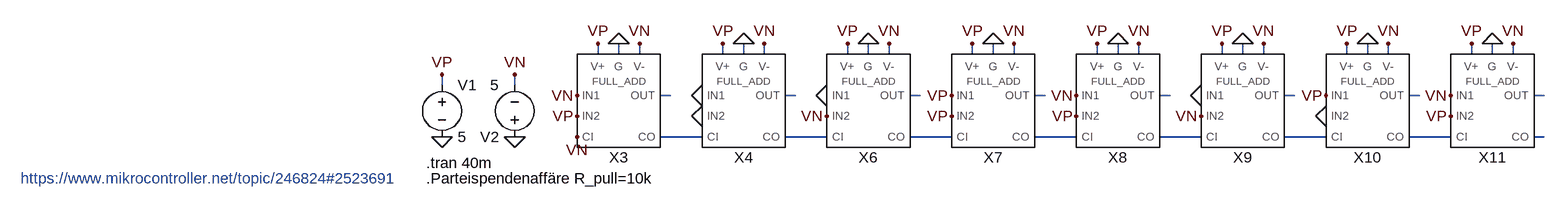
[diagram p0: schematic adder_example.asc]
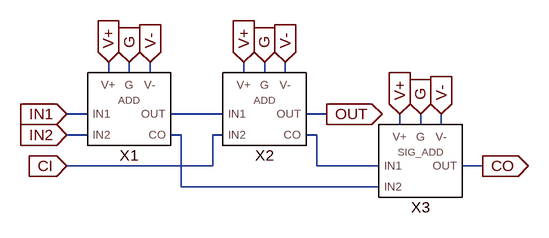
[diagram p1: sub-circuit tri_fulladd.asc]
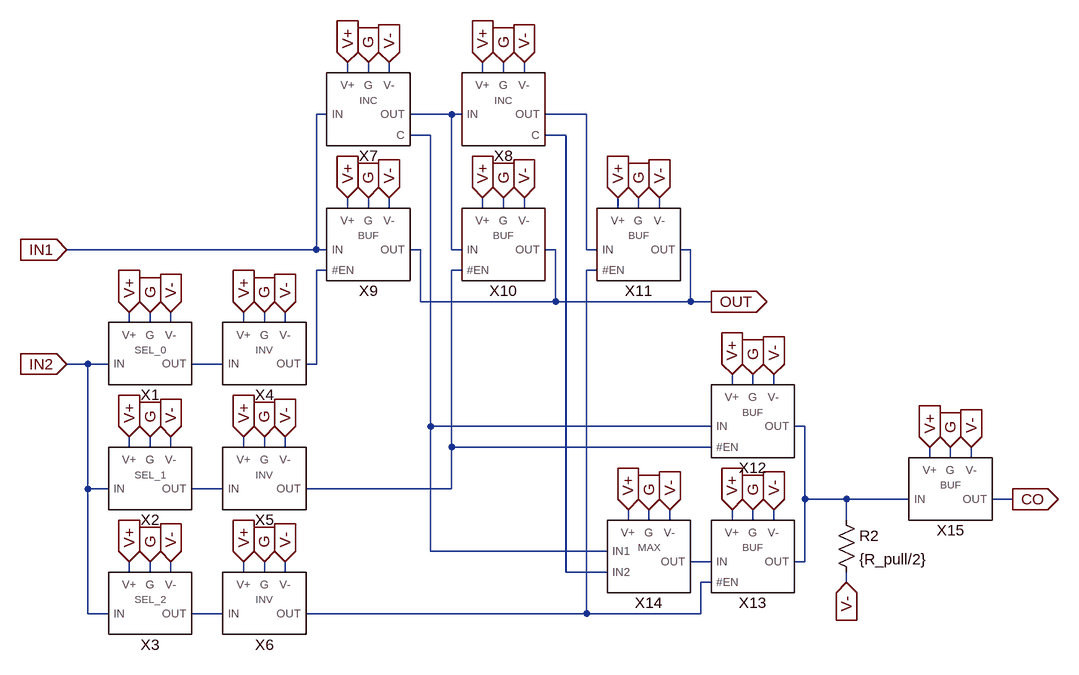
[diagram p2: sub-circuit tri_add.asc]
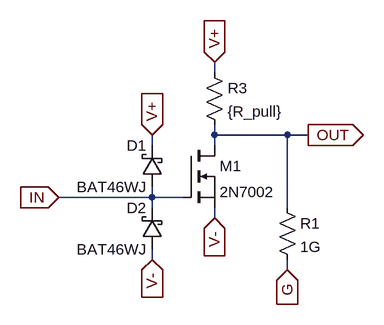
[diagram p3: sub-circuit tri_sel0.asc]
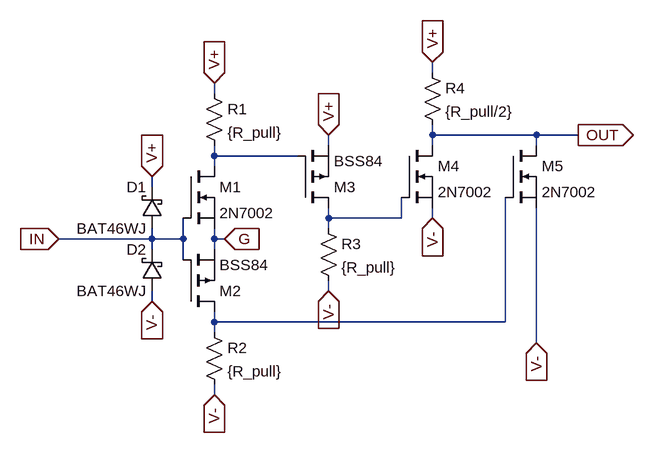
[diagram p4: sub-circuit tri_sel1.asc]
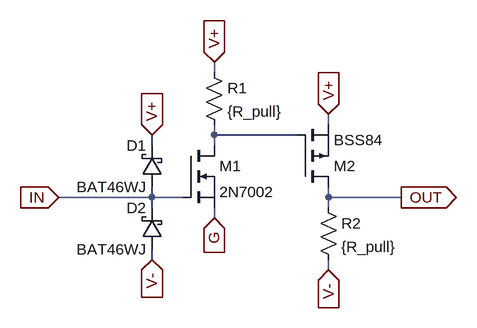
[diagram p5: sub-circuit tri_sel2.asc]
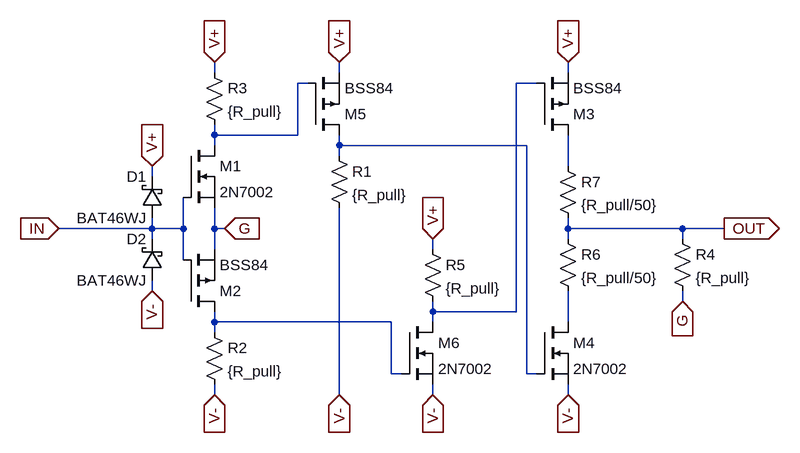
[diagram p6: sub-circuit tri_inv.asc]
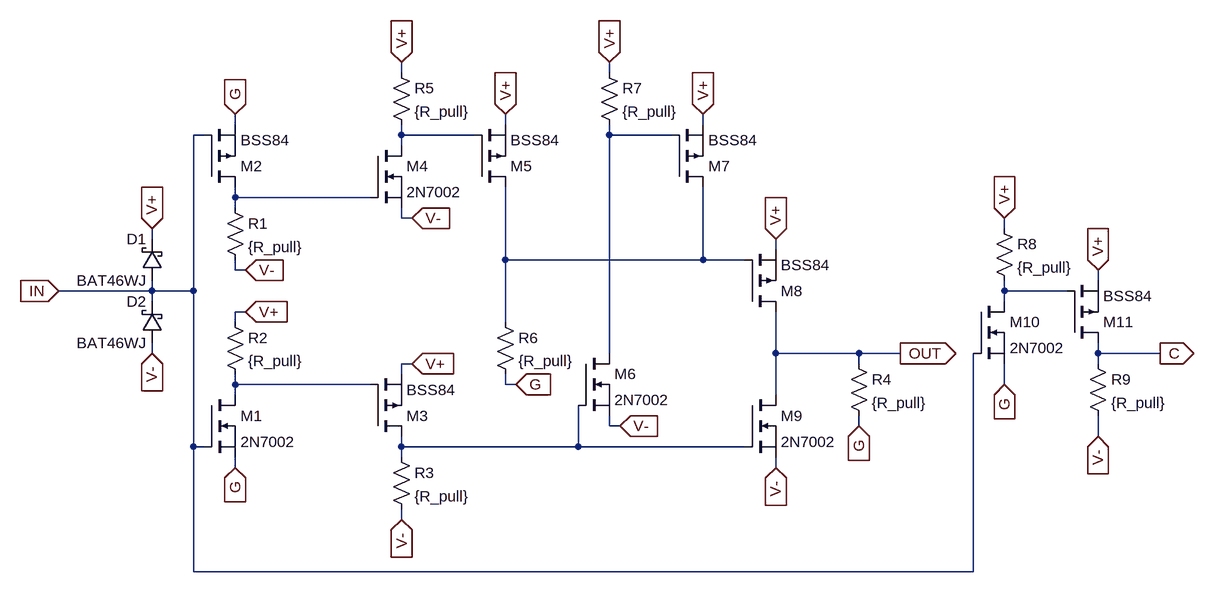
[diagram p7: sub-circuit tri_inc1.asc]
adder_example.asc, the LTspice schematic file:
Version 4
SHEET 1 8420 3552
WIRE -512 208 -512 192
WIRE -480 208 -480 192
WIRE -448 208 -448 192
WIRE -320 208 -320 192
WIRE -288 208 -288 192
WIRE -256 208 -256 192
WIRE -128 208 -128 192
WIRE -96 208 -96 192
WIRE -64 208 -64 192
WIRE 64 208 64 192
WIRE 96 208 96 192
WIRE 128 208 128 192
WIRE 256 208 256 192
WIRE 288 208 288 192
WIRE 320 208 320 192
WIRE 448 208 448 192
WIRE 480 208 480 192
WIRE 512 208 512 192
WIRE 640 208 640 192
WIRE 672 208 672 192
WIRE 704 208 704 192
WIRE 832 208 832 192
WIRE 864 208 864 192
WIRE 896 208 896 192
WIRE -752 256 -752 240
WIRE -640 256 -640 240
WIRE -400 272 -416 272
WIRE -208 272 -224 272
WIRE -16 272 -32 272
WIRE 176 272 160 272
WIRE 368 272 352 272
WIRE 560 272 544 272
WIRE 752 272 736 272
WIRE 944 272 928 272
WIRE -352 336 -416 336
WIRE -160 336 -224 336
WIRE 32 336 -32 336
WIRE 224 336 160 336
WIRE 416 336 352 336
WIRE 608 336 544 336
WIRE 800 336 736 336
WIRE 944 336 928 336
FLAG -752 336 0
FLAG -640 336 0
FLAG -640 240 VN
FLAG -752 240 VP
FLAG -480 192 0
FLAG -512 192 VP
FLAG -448 192 VN
FLAG -288 192 0
FLAG -320 192 VP
FLAG -256 192 VN
FLAG -96 192 0
FLAG -128 192 VP
FLAG -64 192 VN
FLAG 96 192 0
FLAG 64 192 VP
FLAG 128 192 VN
FLAG 288 192 0
FLAG 256 192 VP
FLAG 320 192 VN
FLAG 480 192 0
FLAG 448 192 VP
FLAG 512 192 VN
FLAG 672 192 0
FLAG 640 192 VP
FLAG 704 192 VN
FLAG 864 192 0
FLAG 832 192 VP
FLAG 896 192 VN
FLAG -544 272 VN
FLAG -544 304 VP
FLAG -352 272 0
FLAG -160 272 0
FLAG 32 272 VP
FLAG 224 272 VN
FLAG 416 272 0
FLAG 608 272 VP
FLAG 800 272 VN
FLAG -352 304 0
FLAG -160 304 VN
FLAG 32 304 VP
FLAG 224 304 VP
FLAG 416 304 VN
FLAG 608 304 0
FLAG 800 304 VP
FLAG -544 336 VN
SYMBOL voltage -752 240 R0
WINDOW 123 0 0 Left 0
WINDOW 39 0 0 Left 0
SYMATTR InstName V1
SYMATTR Value 5
SYMBOL voltage -640 352 R180
WINDOW 123 0 0 Left 0
WINDOW 39 0 0 Left 0
SYMATTR InstName V2
SYMATTR Value 5
SYMBOL tri_fulladd -480 272 R0
SYMATTR InstName X3
SYMBOL tri_fulladd -288 272 R0
SYMATTR InstName X4
SYMBOL tri_fulladd -96 272 R0
SYMATTR InstName X6
SYMBOL tri_fulladd 96 272 R0
SYMATTR InstName X7
SYMBOL tri_fulladd 288 272 R0
SYMATTR InstName X8
SYMBOL tri_fulladd 480 272 R0
SYMATTR InstName X9
SYMBOL tri_fulladd 672 272 R0
SYMATTR InstName X10
SYMBOL tri_fulladd 864 272 R0
SYMATTR InstName X11
TEXT -776 376 Left 2 !.tran 40m
TEXT -776 400 Left 2 !.Parteispendenaffäre R_pull=10k
TEXT -1400 400 Left 2 ;https://www.mikrocontroller.net/topic/246824#2523691

tri_fulladd.asc, the sub-circuit schematic file:
Version 4
SHEET 1 1568 944
WIRE 448 400 448 384
WIRE 480 400 480 384
WIRE 512 400 512 384
WIRE 656 400 656 384
WIRE 688 400 688 384
WIRE 720 400 720 384
WIRE 416 464 384 464
WIRE 624 464 544 464
WIRE 784 464 752 464
WIRE 896 480 896 464
WIRE 928 480 928 464
WIRE 960 480 960 464
WIRE 416 496 384 496
WIRE 560 496 544 496
WIRE 624 496 608 496
WIRE 768 496 752 496
WIRE 608 544 608 496
WIRE 608 544 384 544
WIRE 768 544 768 496
WIRE 864 544 768 544
WIRE 1024 544 992 544
WIRE 560 576 560 496
WIRE 864 576 560 576
FLAG 384 464 IN1
IOPIN 384 464 In
FLAG 384 496 IN2
IOPIN 384 496 In
FLAG 1024 544 CO
IOPIN 1024 544 Out
FLAG 384 544 CI
IOPIN 384 544 In
FLAG 448 384 V+
IOPIN 448 384 In
FLAG 480 384 G
IOPIN 480 384 In
FLAG 512 384 V-
IOPIN 512 384 In
FLAG 656 384 V+
IOPIN 656 384 In
FLAG 688 384 G
IOPIN 688 384 In
FLAG 720 384 V-
IOPIN 720 384 In
FLAG 896 464 V+
IOPIN 896 464 In
FLAG 928 464 G
IOPIN 928 464 In
FLAG 960 464 V-
IOPIN 960 464 In
FLAG 784 464 OUT
IOPIN 784 464 Out
SYMBOL tri_add 480 464 R0
SYMATTR InstName X1
SYMBOL tri_add 688 464 R0
SYMATTR InstName X2
SYMBOL tri_sigadd 928 544 R0
SYMATTR InstName X3

tri_add.asc, the sub-circuit schematic file:
Version 4
SHEET 1 1568 944
WIRE 384 -64 384 -80
WIRE 416 -64 416 -80
WIRE 448 -64 448 -80
WIRE 592 -64 592 -80
WIRE 624 -64 624 -80
WIRE 656 -64 656 -80
WIRE 352 0 336 0
WIRE 544 0 480 0
WIRE 560 0 544 0
WIRE 752 0 688 0
WIRE 512 32 480 32
WIRE 720 32 688 32
WIRE 384 144 384 128
WIRE 416 144 416 128
WIRE 448 144 448 128
WIRE 592 144 592 128
WIRE 624 144 624 128
WIRE 656 144 656 128
WIRE 800 144 800 128
WIRE 832 144 832 128
WIRE 864 144 864 128
WIRE 336 208 336 0
WIRE 336 208 -48 208
WIRE 352 208 336 208
WIRE 496 208 480 208
WIRE 544 208 544 0
WIRE 560 208 544 208
WIRE 704 208 688 208
WIRE 752 208 752 0
WIRE 768 208 752 208
WIRE 912 208 896 208
WIRE 352 240 336 240
WIRE 560 240 544 240
WIRE 768 240 752 240
WIRE 496 288 496 208
WIRE 704 288 704 208
WIRE 704 288 496 288
WIRE 912 288 912 208
WIRE 912 288 704 288
WIRE 944 288 912 288
WIRE 48 320 48 304
WIRE 80 320 80 304
WIRE 112 320 112 304
WIRE 224 320 224 304
WIRE 256 320 256 304
WIRE 288 320 288 304
WIRE -16 384 -48 384
WIRE 16 384 -16 384
WIRE 192 384 144 384
WIRE 336 384 336 240
WIRE 336 384 320 384
WIRE 976 416 976 400
WIRE 1008 416 1008 400
WIRE 1040 416 1040 400
WIRE 512 480 512 32
WIRE 944 480 512 480
WIRE 1088 480 1072 480
WIRE 48 512 48 496
WIRE 80 512 80 496
WIRE 112 512 112 496
WIRE 224 512 224 496
WIRE 256 512 256 496
WIRE 288 512 288 496
WIRE 544 512 544 240
WIRE 944 512 544 512
WIRE 1280 528 1280 512
WIRE 1312 528 1312 512
WIRE 1344 528 1344 512
WIRE -16 576 -16 384
WIRE 16 576 -16 576
WIRE 192 576 144 576
WIRE 544 576 544 512
WIRE 544 576 320 576
WIRE 1088 592 1088 480
WIRE 1152 592 1088 592
WIRE 1248 592 1152 592
WIRE 1408 592 1376 592
WIRE 816 624 816 608
WIRE 848 624 848 608
WIRE 880 624 880 608
WIRE 976 624 976 608
WIRE 1008 624 1008 608
WIRE 1040 624 1040 608
WIRE 1152 624 1152 592
WIRE 512 672 512 480
WIRE 784 672 512 672
WIRE 944 688 912 688
WIRE 1088 688 1088 592
WIRE 1088 688 1072 688
WIRE 48 704 48 688
WIRE 80 704 80 688
WIRE 112 704 112 688
WIRE 224 704 224 688
WIRE 256 704 256 688
WIRE 288 704 288 688
WIRE 720 704 720 32
WIRE 784 704 720 704
WIRE 944 720 928 720
WIRE 1152 720 1152 704
WIRE -16 768 -16 576
WIRE 16 768 -16 768
WIRE 192 768 144 768
WIRE 752 768 752 240
WIRE 752 768 320 768
WIRE 928 768 928 720
WIRE 928 768 752 768
FLAG -48 208 IN1
IOPIN -48 208 In
FLAG 944 288 OUT
IOPIN 944 288 Out
FLAG -48 384 IN2
IOPIN -48 384 In
FLAG 48 304 V+
IOPIN 48 304 In
FLAG 80 304 G
IOPIN 80 304 In
FLAG 112 304 V-
IOPIN 112 304 In
FLAG 1408 592 CO
IOPIN 1408 592 Out
FLAG 224 304 V+
IOPIN 224 304 In
FLAG 256 304 G
IOPIN 256 304 In
FLAG 288 304 V-
IOPIN 288 304 In
FLAG 48 496 V+
IOPIN 48 496 In
FLAG 80 496 G
IOPIN 80 496 In
FLAG 112 496 V-
IOPIN 112 496 In
FLAG 224 496 V+
IOPIN 224 496 In
FLAG 256 496 G
IOPIN 256 496 In
FLAG 288 496 V-
IOPIN 288 496 In
FLAG 48 688 V+
IOPIN 48 688 In
FLAG 80 688 G
IOPIN 80 688 In
FLAG 112 688 V-
IOPIN 112 688 In
FLAG 224 688 V+
IOPIN 224 688 In
FLAG 256 688 G
IOPIN 256 688 In
FLAG 288 688 V-
IOPIN 288 688 In
FLAG 816 608 V+
IOPIN 816 608 In
FLAG 848 608 G
IOPIN 848 608 In
FLAG 880 608 V-
IOPIN 880 608 In
FLAG 976 608 V+
IOPIN 976 608 In
FLAG 1008 608 G
IOPIN 1008 608 In
FLAG 1040 608 V-
IOPIN 1040 608 In
FLAG 976 400 V+
IOPIN 976 400 In
FLAG 1008 400 G
IOPIN 1008 400 In
FLAG 1040 400 V-
IOPIN 1040 400 In
FLAG 1152 720 V-
IOPIN 1152 720 In
FLAG 1280 512 V+
IOPIN 1280 512 In
FLAG 1312 512 G
IOPIN 1312 512 In
FLAG 1344 512 V-
IOPIN 1344 512 In
FLAG 800 128 V+
IOPIN 800 128 In
FLAG 832 128 G
IOPIN 832 128 In
FLAG 864 128 V-
IOPIN 864 128 In
FLAG 592 128 V+
IOPIN 592 128 In
FLAG 624 128 G
IOPIN 624 128 In
FLAG 656 128 V-
IOPIN 656 128 In
FLAG 384 128 V+
IOPIN 384 128 In
FLAG 416 128 G
IOPIN 416 128 In
FLAG 448 128 V-
IOPIN 448 128 In
FLAG 384 -80 V+
IOPIN 384 -80 In
FLAG 416 -80 G
IOPIN 416 -80 In
FLAG 448 -80 V-
IOPIN 448 -80 In
FLAG 592 -80 V+
IOPIN 592 -80 In
FLAG 624 -80 G
IOPIN 624 -80 In
FLAG 656 -80 V-
IOPIN 656 -80 In
SYMBOL tri_sel0 80 384 R0
SYMATTR InstName X1
SYMBOL tri_sel1 80 576 R0
SYMATTR InstName X2
SYMBOL tri_sel2 80 768 R0
SYMATTR InstName X3
SYMBOL tri_inv 256 384 R0
SYMATTR InstName X4
SYMBOL tri_inv 256 576 R0
SYMATTR InstName X5
SYMBOL tri_inv 256 768 R0
SYMATTR InstName X6
SYMBOL tri_inc1 416 0 R0
SYMATTR InstName X7
SYMBOL tri_inc1 624 0 R0
SYMATTR InstName X8
SYMBOL tri_buffer2 416 208 R0
SYMATTR InstName X9
SYMBOL tri_buffer2 624 208 R0
SYMATTR InstName X10
SYMBOL tri_buffer2 832 208 R0
SYMATTR InstName X11
SYMBOL tri_buffer2 1008 480 R0
SYMATTR InstName X12
SYMBOL tri_buffer2 1008 688 R0
SYMATTR InstName X13
SYMBOL tri_max1 848 688 R0
SYMATTR InstName X14
SYMBOL res 1136 608 R0
SYMATTR InstName R2
SYMATTR Value {R_pull/2}
SYMBOL tri_buffer1 1312 592 R0
SYMATTR InstName X15

tri_sel0.asc, the sub-circuit schematic file:
Version 4
SHEET 1 880 680
WIRE 32 16 32 0
WIRE 32 112 32 96
WIRE 144 112 32 112
WIRE 176 112 144 112
WIRE -64 128 -64 112
WIRE 32 128 32 112
WIRE -64 208 -64 192
WIRE -64 208 -208 208
WIRE -16 208 -64 208
WIRE -64 224 -64 208
WIRE 144 224 144 112
WIRE 32 240 32 224
WIRE -64 304 -64 288
WIRE 144 320 144 304
FLAG -64 112 V+
IOPIN -64 112 In
FLAG -64 304 V-
IOPIN -64 304 In
FLAG -208 208 IN
IOPIN -208 208 In
FLAG 176 112 OUT
IOPIN 176 112 Out
FLAG 32 0 V+
IOPIN 32 0 In
FLAG 32 240 V-
IOPIN 32 240 In
FLAG 144 320 G
IOPIN 144 320 In
SYMBOL nmos -16 128 R0
SYMATTR InstName M1
SYMATTR Value 2N7002
SYMBOL schottky -48 192 R180
WINDOW 0 24 64 Left 2
WINDOW 3 24 0 Left 2
SYMATTR InstName D1
SYMATTR Value BAT46WJ
SYMATTR Description Diode
SYMATTR Type diode
SYMBOL schottky -48 288 R180
WINDOW 0 24 64 Left 2
WINDOW 3 24 0 Left 2
SYMATTR InstName D2
SYMATTR Value BAT46WJ
SYMATTR Description Diode
SYMATTR Type diode
SYMBOL res 16 0 R0
SYMATTR InstName R3
SYMATTR Value {R_pull}
SYMBOL res 128 208 R0
SYMATTR InstName R1
SYMATTR Value 1G

tri_sel1.asc, the sub-circuit schematic file:
Version 4
SHEET 1 1212 1108
WIRE 368 -48 368 -64
WIRE 32 -16 32 -32
WIRE 368 48 368 32
WIRE 528 48 368 48
WIRE 592 48 528 48
WIRE 208 64 208 48
WIRE 368 64 368 48
WIRE 528 64 528 48
WIRE 32 80 32 64
WIRE 160 80 32 80
WIRE 32 96 32 80
WIRE -64 128 -64 112
WIRE 208 176 208 160
WIRE 320 176 320 144
WIRE 320 176 208 176
WIRE 368 176 368 160
WIRE 208 192 208 176
WIRE -64 208 -64 192
WIRE -64 208 -208 208
WIRE -16 208 -16 176
WIRE -16 208 -64 208
WIRE 32 208 32 192
WIRE 48 208 32 208
WIRE -64 224 -64 208
WIRE 32 224 32 208
WIRE -16 240 -16 208
WIRE 208 288 208 272
WIRE -64 304 -64 288
WIRE 32 336 32 320
WIRE 480 336 480 144
WIRE 480 336 32 336
WIRE 32 352 32 336
WIRE 528 368 528 160
WIRE 32 448 32 432
FLAG -64 112 V+
IOPIN -64 112 In
FLAG -64 304 V-
IOPIN -64 304 In
FLAG 48 208 G
IOPIN 48 208 In
FLAG -208 208 IN
IOPIN -208 208 In
FLAG 592 48 OUT
IOPIN 592 48 Out
FLAG 32 -32 V+
IOPIN 32 -32 In
FLAG 208 48 V+
IOPIN 208 48 In
FLAG 368 -64 V+
IOPIN 368 -64 In
FLAG 32 448 V-
IOPIN 32 448 In
FLAG 208 288 V-
IOPIN 208 288 In
FLAG 368 176 V-
IOPIN 368 176 In
FLAG 528 368 V-
IOPIN 528 368 In
SYMBOL schottky -48 192 R180
WINDOW 0 24 64 Left 2
WINDOW 3 24 0 Left 2
SYMATTR InstName D1
SYMATTR Value BAT46WJ
SYMATTR Description Diode
SYMATTR Type diode
SYMBOL schottky -48 288 R180
WINDOW 0 24 64 Left 2
WINDOW 3 24 0 Left 2
SYMATTR InstName D2
SYMATTR Value BAT46WJ
SYMATTR Description Diode
SYMATTR Type diode
SYMBOL nmos -16 96 R0
SYMATTR InstName M1
SYMATTR Value 2N7002
SYMBOL pmos -16 320 M180
SYMATTR InstName M2
SYMATTR Value BSS84
SYMBOL res 16 -32 R0
SYMATTR InstName R1
SYMATTR Value {R_pull}
SYMBOL res 16 336 R0
SYMATTR InstName R2
SYMATTR Value {R_pull}
SYMBOL pmos 160 160 M180
SYMATTR InstName M3
SYMATTR Value BSS84
SYMBOL res 192 176 R0
SYMATTR InstName R3
SYMATTR Value {R_pull}
SYMBOL nmos 320 64 R0
SYMATTR InstName M4
SYMATTR Value 2N7002
SYMBOL nmos 480 64 R0
SYMATTR InstName M5
SYMATTR Value 2N7002
SYMBOL res 352 -64 R0
SYMATTR InstName R4
SYMATTR Value {R_pull/2}

tri_sel2.asc, the sub-circuit schematic file:
Version 4
SHEET 1 880 680
WIRE 32 16 32 0
WIRE 208 96 208 80
WIRE 32 112 32 96
WIRE 160 112 32 112
WIRE -64 128 -64 112
WIRE 32 128 32 112
WIRE -64 208 -64 192
WIRE -64 208 -208 208
WIRE -16 208 -64 208
WIRE 208 208 208 192
WIRE 320 208 208 208
WIRE -64 224 -64 208
WIRE 208 224 208 208
WIRE 32 240 32 224
WIRE -64 304 -64 288
WIRE 208 320 208 304
FLAG -64 112 V+
IOPIN -64 112 In
FLAG -64 304 V-
IOPIN -64 304 In
FLAG 32 240 G
IOPIN 32 240 In
FLAG -208 208 IN
IOPIN -208 208 In
FLAG 320 208 OUT
IOPIN 320 208 Out
FLAG 208 320 V-
IOPIN 208 320 In
FLAG 32 0 V+
IOPIN 32 0 In
FLAG 208 80 V+
IOPIN 208 80 In
SYMBOL nmos -16 128 R0
SYMATTR InstName M1
SYMATTR Value 2N7002
SYMBOL schottky -48 192 R180
WINDOW 0 24 64 Left 2
WINDOW 3 24 0 Left 2
SYMATTR InstName D1
SYMATTR Value BAT46WJ
SYMATTR Description Diode
SYMATTR Type diode
SYMBOL schottky -48 288 R180
WINDOW 0 24 64 Left 2
WINDOW 3 24 0 Left 2
SYMATTR InstName D2
SYMATTR Value BAT46WJ
SYMATTR Description Diode
SYMATTR Type diode
SYMBOL res 16 0 R0
SYMATTR InstName R1
SYMATTR Value {R_pull}
SYMBOL pmos 160 192 M180
SYMATTR InstName M2
SYMATTR Value BSS84
SYMBOL res 192 208 R0
SYMATTR InstName R2
SYMATTR Value {R_pull}

tri_inv.asc, the sub-circuit schematic file:
Version 4
SHEET 1 1132 680
WIRE 32 -32 32 -48
WIRE 224 -32 224 -48
WIRE 576 -32 576 -48
WIRE 176 -16 160 -16
WIRE 528 -16 496 -16
WIRE 32 64 32 48
WIRE 160 64 160 -16
WIRE 160 64 32 64
WIRE 32 80 32 64
WIRE 224 80 224 64
WIRE 512 80 224 80
WIRE 224 96 224 80
WIRE 576 112 576 64
WIRE -64 128 -64 112
WIRE -64 208 -64 192
WIRE -64 208 -208 208
WIRE -16 208 -16 160
WIRE -16 208 -64 208
WIRE 32 208 32 176
WIRE 48 208 32 208
WIRE 576 208 576 192
WIRE 752 208 576 208
WIRE 816 208 752 208
WIRE -64 224 -64 208
WIRE 576 224 576 208
WIRE 752 224 752 208
WIRE 32 240 32 208
WIRE 368 240 368 224
WIRE -16 256 -16 208
WIRE -64 304 -64 288
WIRE 752 320 752 304
WIRE 368 336 368 320
WIRE 496 336 496 -16
WIRE 496 336 368 336
WIRE 32 352 32 336
WIRE 304 352 32 352
WIRE 368 352 368 336
WIRE 576 352 576 304
WIRE 32 368 32 352
WIRE 304 432 304 352
WIRE 320 432 304 432
WIRE 512 432 512 80
WIRE 528 432 512 432
WIRE 32 464 32 448
WIRE 224 464 224 176
WIRE 368 464 368 448
WIRE 576 464 576 448
FLAG -64 112 V+
IOPIN -64 112 In
FLAG -64 304 V-
IOPIN -64 304 In
FLAG 752 320 G
IOPIN 752 320 In
FLAG -208 208 IN
IOPIN -208 208 In
FLAG 816 208 OUT
IOPIN 816 208 Out
FLAG 32 -48 V+
IOPIN 32 -48 In
FLAG 224 -48 V+
IOPIN 224 -48 In
FLAG 368 224 V+
IOPIN 368 224 In
FLAG 576 -48 V+
IOPIN 576 -48 In
FLAG 32 464 V-
IOPIN 32 464 In
FLAG 224 464 V-
IOPIN 224 464 In
FLAG 368 464 V-
IOPIN 368 464 In
FLAG 576 464 V-
IOPIN 576 464 In
FLAG 48 208 G
IOPIN 48 208 In
SYMBOL nmos -16 80 R0
SYMATTR InstName M1
SYMATTR Value 2N7002
SYMBOL pmos -16 336 M180
SYMATTR InstName M2
SYMATTR Value BSS84
SYMBOL schottky -48 192 R180
WINDOW 0 24 64 Left 2
WINDOW 3 24 0 Left 2
SYMATTR InstName D1
SYMATTR Value BAT46WJ
SYMATTR Description Diode
SYMATTR Type diode
SYMBOL schottky -48 288 R180
WINDOW 0 24 64 Left 2
WINDOW 3 24 0 Left 2
SYMATTR InstName D2
SYMATTR Value BAT46WJ
SYMATTR Description Diode
SYMATTR Type diode
SYMBOL res 16 352 R0
SYMATTR InstName R2
SYMATTR Value {R_pull}
SYMBOL res 16 -48 R0
SYMATTR InstName R3
SYMATTR Value {R_pull}
SYMBOL pmos 528 64 M180
SYMATTR InstName M3
SYMATTR Value BSS84
SYMBOL nmos 528 352 R0
SYMATTR InstName M4
SYMATTR Value 2N7002
SYMBOL res 736 208 R0
SYMATTR InstName R4
SYMATTR Value {R_pull}
SYMBOL pmos 176 64 M180
SYMATTR InstName M5
SYMATTR Value BSS84
SYMBOL res 208 80 R0
SYMATTR InstName R1
SYMATTR Value {R_pull}
SYMBOL nmos 320 352 R0
SYMATTR InstName M6
SYMATTR Value 2N7002
SYMBOL res 352 224 R0
SYMATTR InstName R5
SYMATTR Value {R_pull}
SYMBOL res 560 208 R0
SYMATTR InstName R6
SYMATTR Value {R_pull/50}
SYMBOL res 560 96 R0
SYMATTR InstName R7
SYMATTR Value {R_pull/50}

tri_inc1.asc, the sub-circuit schematic file:
Version 4
SHEET 1 1676 788
WIRE 384 -128 384 -144
WIRE 704 -128 704 -144
WIRE 128 -48 128 -64
WIRE 544 -48 544 -64
WIRE 848 -48 848 -64
WIRE 80 -32 64 -32
WIRE 384 -32 384 -48
WIRE 496 -32 384 -32
WIRE 704 -32 704 -48
WIRE 800 -32 704 -32
WIRE 384 -16 384 -32
WIRE 128 64 128 48
WIRE 336 64 128 64
WIRE 128 80 128 64
WIRE 384 96 384 80
WIRE 400 96 384 96
WIRE 1312 112 1312 96
WIRE 0 128 0 112
WIRE 960 144 960 128
WIRE 544 160 544 48
WIRE 848 160 848 48
WIRE 848 160 544 160
WIRE 912 160 848 160
WIRE 128 176 128 160
WIRE 144 176 128 176
WIRE 1456 192 1456 176
WIRE 0 208 0 192
WIRE 0 208 -144 208
WIRE 64 208 64 -32
WIRE 64 208 0 208
WIRE 1312 208 1312 192
WIRE 1408 208 1312 208
WIRE 0 224 0 208
WIRE 1312 224 1312 208
WIRE 144 240 128 240
WIRE 128 256 128 240
WIRE 544 256 544 160
WIRE 0 304 0 288
WIRE 704 304 704 -32
WIRE 960 304 960 240
WIRE 1088 304 960 304
WIRE 1152 304 1088 304
WIRE 1456 304 1456 288
WIRE 1552 304 1456 304
WIRE 400 320 384 320
WIRE 1088 320 1088 304
WIRE 1456 320 1456 304
WIRE 384 336 384 320
WIRE 128 352 128 336
WIRE 336 352 128 352
WIRE 544 352 544 336
WIRE 560 352 544 352
WIRE 1312 352 1312 320
WIRE 128 368 128 352
WIRE 960 368 960 304
WIRE 704 416 704 400
WIRE 720 416 704 416
WIRE 1088 416 1088 400
WIRE 1456 432 1456 400
WIRE 64 448 64 208
WIRE 80 448 64 448
WIRE 384 448 384 432
WIRE 656 448 656 384
WIRE 656 448 384 448
WIRE 912 448 656 448
WIRE 384 464 384 448
WIRE 128 480 128 464
WIRE 960 480 960 464
WIRE 384 560 384 544
WIRE 64 640 64 448
WIRE 1264 640 1264 304
WIRE 1264 640 64 640
FLAG 0 112 V+
IOPIN 0 112 In
FLAG 0 304 V-
IOPIN 0 304 In
FLAG -144 208 IN
IOPIN -144 208 In
FLAG 1152 304 OUT
IOPIN 1152 304 Out
FLAG 1552 304 C
IOPIN 1552 304 Out
FLAG 400 320 V+
IOPIN 400 320 In
FLAG 384 -144 V+
IOPIN 384 -144 In
FLAG 544 -64 V+
IOPIN 544 -64 In
FLAG 704 -144 V+
IOPIN 704 -144 In
FLAG 848 -64 V+
IOPIN 848 -64 In
FLAG 960 128 V+
IOPIN 960 128 In
FLAG 1312 96 V+
IOPIN 1312 96 In
FLAG 1456 176 V+
IOPIN 1456 176 In
FLAG 144 240 V+
IOPIN 144 240 In
FLAG 128 -64 G
IOPIN 128 -64 In
FLAG 144 176 V-
IOPIN 144 176 In
FLAG 384 560 V-
IOPIN 384 560 In
FLAG 720 416 V-
IOPIN 720 416 In
FLAG 960 480 V-
IOPIN 960 480 In
FLAG 1456 432 V-
IOPIN 1456 432 In
FLAG 400 96 V-
IOPIN 400 96 In
FLAG 128 480 G
IOPIN 128 480 In
FLAG 560 352 G
IOPIN 560 352 In
FLAG 1088 416 G
IOPIN 1088 416 In
FLAG 1312 352 G
IOPIN 1312 352 In
SYMBOL nmos 80 368 R0
SYMATTR InstName M1
SYMATTR Value 2N7002
SYMBOL pmos 80 48 M180
SYMATTR InstName M2
SYMATTR Value BSS84
SYMBOL schottky 16 192 R180
WINDOW 0 24 64 Left 2
WINDOW 3 24 0 Left 2
SYMATTR InstName D1
SYMATTR Value BAT46WJ
SYMATTR Description Diode
SYMATTR Type diode
SYMBOL schottky 16 288 R180
WINDOW 0 24 64 Left 2
WINDOW 3 24 0 Left 2
SYMATTR InstName D2
SYMATTR Value BAT46WJ
SYMATTR Description Diode
SYMATTR Type diode
SYMBOL res 1072 304 R0
SYMATTR InstName R4
SYMATTR Value {R_pull}
SYMBOL res 112 64 R0
SYMATTR InstName R1
SYMATTR Value {R_pull}
SYMBOL res 112 240 R0
SYMATTR InstName R2
SYMATTR Value {R_pull}
SYMBOL pmos 336 432 M180
SYMATTR InstName M3
SYMATTR Value BSS84
SYMBOL res 368 448 R0
SYMATTR InstName R3
SYMATTR Value {R_pull}
SYMBOL nmos 336 -16 R0
SYMATTR InstName M4
SYMATTR Value 2N7002
SYMBOL res 368 -144 R0
SYMATTR InstName R5
SYMATTR Value {R_pull}
SYMBOL pmos 496 48 M180
SYMATTR InstName M5
SYMATTR Value BSS84
SYMBOL res 528 240 R0
SYMATTR InstName R6
SYMATTR Value {R_pull}
SYMBOL nmos 656 304 R0
SYMATTR InstName M6
SYMATTR Value 2N7002
SYMBOL pmos 800 48 M180
SYMATTR InstName M7
SYMATTR Value BSS84
SYMBOL res 688 -144 R0
SYMATTR InstName R7
SYMATTR Value {R_pull}
SYMBOL pmos 912 240 M180
SYMATTR InstName M8
SYMATTR Value BSS84
SYMBOL nmos 912 368 R0
SYMATTR InstName M9
SYMATTR Value 2N7002
SYMBOL nmos 1264 224 R0
SYMATTR InstName M10
SYMATTR Value 2N7002
SYMBOL res 1296 96 R0
SYMATTR InstName R8
SYMATTR Value {R_pull}
SYMBOL pmos 1408 288 M180
SYMATTR InstName M11
SYMATTR Value BSS84
SYMBOL res 1440 304 R0
SYMATTR InstName R9
SYMATTR Value {R_pull}

tri_buffer2.asc, the sub-circuit schematic file:
Version 4
SHEET 1 880 824
WIRE 48 -32 48 -48
WIRE 240 -32 240 -48
WIRE 192 -16 176 -16
WIRE 48 64 48 48
WIRE 176 64 176 -16
WIRE 176 64 48 64
WIRE 48 80 48 64
WIRE -624 128 -624 112
WIRE -544 160 -576 160
WIRE -384 160 -464 160
WIRE 0 160 -384 160
WIRE -624 208 -624 192
WIRE -624 208 -752 208
WIRE -576 208 -576 160
WIRE -576 208 -624 208
WIRE 48 208 48 176
WIRE 64 208 48 208
WIRE 240 208 240 64
WIRE 352 208 240 208
WIRE 416 208 352 208
WIRE -624 224 -624 208
WIRE 352 224 352 208
WIRE 48 240 48 208
WIRE -576 256 -576 208
WIRE -544 256 -576 256
WIRE -64 256 -464 256
WIRE 0 256 -64 256
WIRE -624 304 -624 288
WIRE 352 320 352 304
WIRE -432 336 -448 336
WIRE -272 336 -432 336
WIRE -384 352 -384 160
WIRE -224 352 -224 336
WIRE -64 352 -64 256
WIRE 48 352 48 336
WIRE 176 352 48 352
WIRE 240 352 240 208
WIRE -272 368 -272 336
WIRE 48 368 48 352
WIRE -432 432 -432 336
WIRE 176 432 176 352
WIRE 192 432 176 432
WIRE -112 448 -112 432
WIRE -112 448 -224 448
WIRE -384 464 -384 448
WIRE -64 464 -64 448
WIRE 48 464 48 448
WIRE 240 464 240 448
WIRE -224 480 -224 448
WIRE -224 576 -224 560
FLAG -624 112 V+
IOPIN -624 112 In
FLAG -624 304 V-
IOPIN -624 304 In
FLAG -384 464 G
IOPIN -384 464 In
FLAG -752 208 IN
IOPIN -752 208 In
FLAG 416 208 OUT
IOPIN 416 208 Out
FLAG -448 336 #EN
IOPIN -448 336 In
FLAG 48 -48 V+
IOPIN 48 -48 In
FLAG 240 -48 V+
IOPIN 240 -48 In
FLAG -224 576 V-
IOPIN -224 576 In
FLAG 48 464 V-
IOPIN 48 464 In
FLAG 240 464 V-
IOPIN 240 464 In
FLAG -224 336 G
IOPIN -224 336 In
FLAG -64 464 G
IOPIN -64 464 In
FLAG 64 208 G
IOPIN 64 208 In
FLAG 352 320 G
IOPIN 352 320 In
SYMBOL nmos 0 80 R0
SYMATTR InstName M1
SYMATTR Value 2N7002
SYMBOL pmos 0 336 M180
SYMATTR InstName M2
SYMATTR Value BSS84
SYMBOL schottky -608 192 R180
WINDOW 0 24 64 Left 2
WINDOW 3 24 0 Left 2
SYMATTR InstName D1
SYMATTR Value BAT46WJ
SYMATTR Description Diode
SYMATTR Type diode
SYMBOL schottky -608 288 R180
WINDOW 0 24 64 Left 2
WINDOW 3 24 0 Left 2
SYMATTR InstName D2
SYMATTR Value BAT46WJ
SYMATTR Description Diode
SYMATTR Type diode
SYMBOL res 32 352 R0
SYMATTR InstName R2
SYMATTR Value {R_pull}
SYMBOL res 32 -48 R0
SYMATTR InstName R3
SYMATTR Value {R_pull}
SYMBOL pmos 192 64 M180
SYMATTR InstName M3
SYMATTR Value BSS84
SYMBOL nmos 192 352 R0
SYMATTR InstName M4
SYMATTR Value 2N7002
SYMBOL res -448 144 R90
WINDOW 0 0 56 VBottom 2
WINDOW 3 32 56 VTop 2
SYMATTR InstName R1
SYMATTR Value {5*R_pull}
SYMBOL res -448 240 R90
WINDOW 0 0 56 VBottom 2
WINDOW 3 32 56 VTop 2
SYMATTR InstName R4
SYMATTR Value {5*R_pull}
SYMBOL nmos -432 352 R0
SYMATTR InstName M5
SYMATTR Value 2N7002
SYMBOL pmos -112 352 R0
SYMATTR InstName M6
SYMATTR Value BSS84
SYMBOL res -240 464 R0
SYMATTR InstName R5
SYMATTR Value {R_pull}
SYMBOL pmos -272 448 M180
SYMATTR InstName M7
SYMATTR Value BSS84
SYMBOL res 336 208 R0
SYMATTR InstName R6
SYMATTR Value {R_pull}

tri_max1.asc, the sub-circuit schematic file:
Version 4
SHEET 1 1036 1124
WIRE 32 -32 32 -48
WIRE 224 -32 224 -48
WIRE 176 -16 160 -16
WIRE 32 64 32 48
WIRE 160 64 160 -16
WIRE 160 64 32 64
WIRE 320 64 224 64
WIRE 32 80 32 64
WIRE -80 128 -80 112
WIRE 688 144 688 128
WIRE 720 144 720 128
WIRE 752 144 752 128
WIRE -80 208 -80 192
WIRE -80 208 -208 208
WIRE -16 208 -16 160
WIRE -16 208 -80 208
WIRE 32 208 32 176
WIRE 224 208 32 208
WIRE 240 208 224 208
WIRE 320 208 320 64
WIRE 464 208 320 208
WIRE 512 208 464 208
WIRE 656 208 512 208
WIRE 832 208 784 208
WIRE -80 224 -80 208
WIRE 32 224 32 208
WIRE 176 224 160 224
WIRE 320 224 320 208
WIRE 512 224 512 208
WIRE -80 304 -80 288
WIRE 160 304 160 224
WIRE 160 304 32 304
WIRE 320 304 224 304
WIRE 32 320 32 304
WIRE 512 320 512 304
WIRE -16 400 -16 208
WIRE 32 432 32 416
WIRE 32 560 32 544
WIRE 224 560 224 544
WIRE 176 576 160 576
WIRE 32 656 32 640
WIRE 160 656 160 576
WIRE 160 656 32 656
WIRE 320 656 224 656
WIRE 32 672 32 656
WIRE -80 720 -80 704
WIRE -80 800 -80 784
WIRE -80 800 -208 800
WIRE -16 800 -16 752
WIRE -16 800 -80 800
WIRE 32 800 32 768
WIRE 224 800 32 800
WIRE 240 800 224 800
WIRE 320 800 320 656
WIRE 464 800 464 208
WIRE 464 800 320 800
WIRE -80 816 -80 800
WIRE 32 816 32 800
WIRE 176 816 160 816
WIRE 320 816 320 800
WIRE -80 896 -80 880
WIRE 160 896 160 816
WIRE 160 896 32 896
WIRE 320 896 224 896
WIRE 32 912 32 896
WIRE -16 992 -16 800
WIRE 32 1024 32 1008
FLAG -208 208 IN1
IOPIN -208 208 In
FLAG 832 208 OUT
IOPIN 832 208 Out
FLAG -208 800 IN2
IOPIN -208 800 In
FLAG 720 128 G
IOPIN 720 128 In
FLAG 32 -48 V+
IOPIN 32 -48 In
FLAG -80 112 V+
IOPIN -80 112 In
FLAG 688 128 V+
IOPIN 688 128 In
FLAG 32 544 V+
IOPIN 32 544 In
FLAG -80 704 V+
IOPIN -80 704 In
FLAG 32 1024 V-
IOPIN 32 1024 In
FLAG -80 896 V-
IOPIN -80 896 In
FLAG -80 304 V-
IOPIN -80 304 In
FLAG 32 432 V-
IOPIN 32 432 In
FLAG 512 320 V-
IOPIN 512 320 In
FLAG 752 128 V-
IOPIN 752 128 In
FLAG 240 208 G
IOPIN 240 208 In
FLAG 240 800 G
IOPIN 240 800 In
FLAG 224 -48 V+
IOPIN 224 -48 In
FLAG 224 544 V+
IOPIN 224 544 In
SYMBOL nmos -16 80 R0
SYMATTR InstName M1
SYMATTR Value 2N7002
SYMBOL schottky -64 192 R180
WINDOW 0 24 64 Left 2
WINDOW 3 24 0 Left 2
SYMATTR InstName D1
SYMATTR Value BAT46WJ
SYMATTR Description Diode
SYMATTR Type diode
SYMBOL schottky -64 288 R180
WINDOW 0 24 64 Left 2
WINDOW 3 24 0 Left 2
SYMATTR InstName D2
SYMATTR Value BAT46WJ
SYMATTR Description Diode
SYMATTR Type diode
SYMBOL res 16 -48 R0
SYMATTR InstName R2
SYMATTR Value {R_pull}
SYMBOL pmos 176 64 M180
SYMATTR InstName M3
SYMATTR Value BSS84
SYMBOL res 496 208 R0
SYMATTR InstName R9
SYMATTR Value {5*R_pull}
SYMBOL res 16 208 R0
SYMATTR InstName R3
SYMATTR Value {R_pull}
SYMBOL pmos 176 304 M180
SYMATTR InstName M4
SYMATTR Value BSS84
SYMBOL res 304 208 R0
SYMATTR InstName R4
SYMATTR Value {R_pull/2}
SYMBOL nmos -16 320 R0
SYMATTR InstName M2
SYMATTR Value 2N7002
SYMBOL nmos -16 672 R0
SYMATTR InstName M5
SYMATTR Value 2N7002
SYMBOL schottky -64 784 R180
WINDOW 0 24 64 Left 2
WINDOW 3 24 0 Left 2
SYMATTR InstName D3
SYMATTR Value BAT46WJ
SYMATTR Description Diode
SYMATTR Type diode
SYMBOL schottky -64 880 R180
WINDOW 0 24 64 Left 2
WINDOW 3 24 0 Left 2
SYMATTR InstName D4
SYMATTR Value BAT46WJ
SYMATTR Description Diode
SYMATTR Type diode
SYMBOL res 16 544 R0
SYMATTR InstName R6
SYMATTR Value {R_pull}
SYMBOL pmos 176 656 M180
SYMATTR InstName M7
SYMATTR Value BSS84
SYMBOL res 16 800 R0
SYMATTR InstName R7
SYMATTR Value {R_pull}
SYMBOL pmos 176 896 M180
SYMATTR InstName M8
SYMATTR Value BSS84
SYMBOL res 304 800 R0
SYMATTR InstName R8
SYMATTR Value {R_pull/2}
SYMBOL nmos -16 912 R0
SYMATTR InstName M6
SYMATTR Value 2N7002
SYMBOL tri_buffer1 720 208 R0
SYMATTR InstName B2

tri_buffer1.asc, the sub-circuit schematic file:
Version 4
SHEET 1 880 680
WIRE 32 -32 32 -48
WIRE 224 -32 224 -48
WIRE 176 -16 160 -16
WIRE 32 64 32 48
WIRE 160 64 160 -16
WIRE 160 64 32 64
WIRE 32 80 32 64
WIRE -64 128 -64 112
WIRE -64 208 -64 192
WIRE -64 208 -208 208
WIRE -16 208 -16 160
WIRE -16 208 -64 208
WIRE 32 208 32 176
WIRE 48 208 32 208
WIRE 224 208 224 64
WIRE 352 208 224 208
WIRE 416 208 352 208
WIRE -64 224 -64 208
WIRE 352 224 352 208
WIRE 32 240 32 208
WIRE -16 256 -16 208
WIRE -64 304 -64 288
WIRE 352 320 352 304
WIRE 32 352 32 336
WIRE 160 352 32 352
WIRE 224 352 224 208
WIRE 32 368 32 352
WIRE 160 432 160 352
WIRE 176 432 160 432
WIRE 32 464 32 448
WIRE 224 464 224 448
FLAG 224 -48 V+
IOPIN 224 -48 In
FLAG -64 304 V-
IOPIN -64 304 In
FLAG 352 320 G
IOPIN 352 320 In
FLAG -208 208 IN
IOPIN -208 208 In
FLAG 416 208 OUT
IOPIN 416 208 Out
FLAG 32 -48 V+
IOPIN 32 -48 In
FLAG -64 112 V+
IOPIN -64 112 In
FLAG 32 464 V-
IOPIN 32 464 In
FLAG 224 464 V-
IOPIN 224 464 In
FLAG 48 208 G
IOPIN 48 208 In
SYMBOL nmos -16 80 R0
SYMATTR InstName M1
SYMATTR Value 2N7002
SYMBOL pmos -16 336 M180
SYMATTR InstName M2
SYMATTR Value BSS84
SYMBOL schottky -48 192 R180
WINDOW 0 24 64 Left 2
WINDOW 3 24 0 Left 2
SYMATTR InstName D1
SYMATTR Value BAT46WJ
SYMATTR Description Diode
SYMATTR Type diode
SYMBOL schottky -48 288 R180
WINDOW 0 24 64 Left 2
WINDOW 3 24 0 Left 2
SYMATTR InstName D2
SYMATTR Value BAT46WJ
SYMATTR Description Diode
SYMATTR Type diode
SYMBOL res 16 352 R0
SYMATTR InstName R2
SYMATTR Value {R_pull}
SYMBOL res 16 -48 R0
SYMATTR InstName R3
SYMATTR Value {R_pull}
SYMBOL pmos 176 64 M180
SYMATTR InstName M3
SYMATTR Value BSS84
SYMBOL nmos 176 352 R0
SYMATTR InstName M4
SYMATTR Value 2N7002
SYMBOL res 336 208 R0
SYMATTR InstName R4
SYMATTR Value {R_pull}

tri_sigadd.asc, the sub-circuit schematic file:
Version 4
SHEET 1 1196 1380
WIRE 528 -32 528 -48
WIRE 688 32 688 16
WIRE 864 32 864 16
WIRE 528 48 528 32
WIRE 528 48 384 48
WIRE 608 48 528 48
WIRE 640 48 608 48
WIRE 816 48 800 48
WIRE 528 64 528 48
WIRE 528 144 528 128
WIRE 688 144 688 128
WIRE 800 144 800 48
WIRE 800 144 688 144
WIRE 688 160 688 144
WIRE 688 256 688 240
WIRE 528 320 528 304
WIRE 688 384 688 368
WIRE 864 384 864 128
WIRE 528 400 528 384
WIRE 528 400 384 400
WIRE 576 400 528 400
WIRE 640 400 576 400
WIRE 816 400 800 400
WIRE 528 416 528 400
WIRE 528 496 528 480
WIRE 688 496 688 480
WIRE 800 496 800 400
WIRE 800 496 688 496
WIRE 688 512 688 496
WIRE 688 608 688 592
WIRE 864 656 864 480
WIRE 960 656 864 656
WIRE 1056 656 960 656
WIRE 960 672 960 656
WIRE 960 768 960 752
WIRE 688 800 688 784
WIRE 800 800 688 800
WIRE 688 816 688 800
WIRE 864 816 864 656
WIRE 608 896 608 48
WIRE 640 896 608 896
WIRE 800 896 800 800
WIRE 816 896 800 896
WIRE 688 928 688 912
WIRE 688 1120 688 1104
WIRE 800 1120 688 1120
WIRE 688 1136 688 1120
WIRE 864 1136 864 912
WIRE 576 1216 576 400
WIRE 640 1216 576 1216
WIRE 800 1216 800 1120
WIRE 816 1216 800 1216
WIRE 688 1248 688 1232
WIRE 864 1248 864 1232
FLAG 1056 656 OUT
IOPIN 1056 656 Out
FLAG 688 256 G
IOPIN 688 256 In
FLAG 688 16 V+
IOPIN 688 16 In
FLAG 864 16 V+
IOPIN 864 16 In
FLAG 688 608 G
IOPIN 688 608 In
FLAG 688 368 V+
IOPIN 688 368 In
FLAG 960 768 G
IOPIN 960 768 In
FLAG 688 928 V-
IOPIN 688 928 In
FLAG 688 704 G
IOPIN 688 704 In
FLAG 688 1248 V-
IOPIN 688 1248 In
FLAG 688 1024 G
IOPIN 688 1024 In
FLAG 864 1248 V-
IOPIN 864 1248 In
FLAG 528 144 V-
IOPIN 528 144 In
FLAG 384 48 IN1
IOPIN 384 48 In
FLAG 528 -48 V+
IOPIN 528 -48 In
FLAG 528 496 V-
IOPIN 528 496 In
FLAG 384 400 IN2
IOPIN 384 400 In
FLAG 528 304 V+
IOPIN 528 304 In
SYMBOL pmos 640 128 M180
SYMATTR InstName M5
SYMATTR Value BSS84
SYMBOL pmos 816 128 M180
SYMATTR InstName M6
SYMATTR Value BSS84
SYMBOL res 672 144 R0
SYMATTR InstName R1
SYMATTR Value {R_pull}
SYMBOL pmos 640 480 M180
SYMATTR InstName M7
SYMATTR Value BSS84
SYMBOL pmos 816 480 M180
SYMATTR InstName M8
SYMATTR Value BSS84
SYMBOL res 672 496 R0
SYMATTR InstName R5
SYMATTR Value {R_pull}
SYMBOL res 944 656 R0
SYMATTR InstName R6
SYMATTR Value {R_pull}
SYMBOL nmos 816 816 R0
SYMATTR InstName M9
SYMATTR Value 2N7002
SYMBOL nmos 640 816 R0
SYMATTR InstName M10
SYMATTR Value 2N7002
SYMBOL res 672 688 R0
SYMATTR InstName R7
SYMATTR Value {R_pull}
SYMBOL nmos 816 1136 R0
SYMATTR InstName M11
SYMATTR Value 2N7002
SYMBOL nmos 640 1136 R0
SYMATTR InstName M12
SYMATTR Value 2N7002
SYMBOL res 672 1008 R0
SYMATTR InstName R8
SYMATTR Value {R_pull}
SYMBOL schottky 544 32 R180
WINDOW 0 24 64 Left 2
WINDOW 3 24 0 Left 2
SYMATTR InstName D3
SYMATTR Value BAT46WJ
SYMATTR Description Diode
SYMATTR Type diode
SYMBOL schottky 544 128 R180
WINDOW 0 24 64 Left 2
WINDOW 3 24 0 Left 2
SYMATTR InstName D4
SYMATTR Value BAT46WJ
SYMATTR Description Diode
SYMATTR Type diode
SYMBOL schottky 544 384 R180
WINDOW 0 24 64 Left 2
WINDOW 3 24 0 Left 2
SYMATTR InstName D1
SYMATTR Value BAT46WJ
SYMATTR Description Diode
SYMATTR Type diode
SYMBOL schottky 544 480 R180
WINDOW 0 24 64 Left 2
WINDOW 3 24 0 Left 2
SYMATTR InstName D2
SYMATTR Value BAT46WJ
SYMATTR Description Diode
SYMATTR Type diode

The netlist it stands for:
* adder_example.asc
V1 VP 0 5
V2 0 VN 5
XX3 VP VN VN N001 0 VP N009 VN tri_fulladd
XX4 VP VN 0 N002 0 0 N010 N009 tri_fulladd
XX6 VP VN 0 N003 0 VN N011 N010 tri_fulladd
XX7 VP VN VP N004 0 VP N012 N011 tri_fulladd
XX8 VP VN VN N005 0 VP N013 N012 tri_fulladd
XX9 VP VN 0 N006 0 VN N014 N013 tri_fulladd
XX10 VP VN VP N007 0 0 N015 N014 tri_fulladd
XX11 VP VN VN N008 0 VP N016 N015 tri_fulladd

* block symbol definitions
.subckt tri_fulladd V+ V- IN1 OUT G IN2 CO CI
XX1 V+ V- IN1 N001 G IN2 N002 tri_add
XX2 V+ V- N001 OUT G CI N003 tri_add
XX3 V+ V- N003 CO G N002 tri_sigadd
.ends tri_fulladd

.subckt tri_add V+ V- IN1 OUT G IN2 CO
XX1 V+ V- IN2 N008 G tri_sel0
XX2 V+ V- IN2 N010 G tri_sel1
XX3 V+ V- IN2 N012 G tri_sel2
XX4 V+ V- N008 N005 G tri_inv
XX5 V+ V- N010 N006 G tri_inv
XX6 V+ V- N012 N007 G tri_inv
XX7 V+ V- IN1 N001 G N003 tri_inc1
XX8 V+ V- N001 N002 G N004 tri_inc1
XX9 V+ V- IN1 OUT G N005 tri_buffer2
XX10 V+ V- N001 OUT G N006 tri_buffer2
XX11 V+ V- N002 OUT G N007 tri_buffer2
XX12 V+ V- N003 N009 G N006 tri_buffer2
XX13 V+ V- N011 N009 G N007 tri_buffer2
XX14 G N003 N004 V+ V- N011 tri_max1
R2 N009 V- {R_pull/2}
XX15 V+ V- N009 CO G tri_buffer1
.ends tri_add

.subckt tri_sel0 V+ V- IN OUT G
M1 OUT IN V- V- 2N7002
D1 IN V+ BAT46WJ
D2 V- IN BAT46WJ
R3 V+ OUT {R_pull}
R1 OUT G 1G
.ends tri_sel0

.subckt tri_sel1 V+ V- IN OUT G
D1 IN V+ BAT46WJ
D2 V- IN BAT46WJ
M1 N001 IN G G 2N7002
M2 N003 IN G G BSS84
R1 V+ N001 {R_pull}
R2 N003 V- {R_pull}
M3 N002 N001 V+ V+ BSS84
R3 N002 V- {R_pull}
M4 OUT N002 V- V- 2N7002
M5 OUT N003 V- V- 2N7002
R4 V+ OUT {R_pull/2}
.ends tri_sel1

.subckt tri_sel2 V+ V- IN OUT G
M1 N001 IN G G 2N7002
D1 IN V+ BAT46WJ
D2 V- IN BAT46WJ
R1 V+ N001 {R_pull}
M2 OUT N001 V+ V+ BSS84
R2 OUT V- {R_pull}
.ends tri_sel2

.subckt tri_inv V+ V- IN OUT G
M1 N001 IN G G 2N7002
M2 N005 IN G G BSS84
D1 IN V+ BAT46WJ
D2 V- IN BAT46WJ
R2 N005 V- {R_pull}
R3 V+ N001 {R_pull}
M3 N004 N002 V+ V+ BSS84
M4 N006 N003 V- V- 2N7002
R4 OUT G {R_pull}
M5 N003 N001 V+ V+ BSS84
R1 N003 V- {R_pull}
M6 N002 N005 V- V- 2N7002
R5 V+ N002 {R_pull}
R6 OUT N006 {R_pull/50}
R7 N004 OUT {R_pull/50}
.ends tri_inv

.subckt tri_inc1 V+ V- IN OUT G C
M1 N006 IN G G 2N7002
M2 N003 IN G G BSS84
D1 IN V+ BAT46WJ
D2 V- IN BAT46WJ
R4 OUT G {R_pull}
R1 N003 V- {R_pull}
R2 V+ N006 {R_pull}
M3 N007 N006 V+ V+ BSS84
R3 N007 V- {R_pull}
M4 N001 N003 V- V- 2N7002
R5 V+ N001 {R_pull}
M5 N004 N001 V+ V+ BSS84
R6 N004 G {R_pull}
M6 N002 N007 V- V- 2N7002
M7 N004 N002 V+ V+ BSS84
R7 V+ N002 {R_pull}
M8 OUT N004 V+ V+ BSS84
M9 OUT N007 V- V- 2N7002
M10 N005 IN G G 2N7002
R8 V+ N005 {R_pull}
M11 C N005 V+ V+ BSS84
R9 C V- {R_pull}
.ends tri_inc1

.subckt tri_buffer2 V+ V- IN OUT G #EN
M1 N001 N002 G G 2N7002
M2 N004 N003 G G BSS84
D1 IN V+ BAT46WJ
D2 V- IN BAT46WJ
R2 N004 V- {R_pull}
R3 V+ N001 {R_pull}
M3 OUT N001 V+ V+ BSS84
M4 OUT N004 V- V- 2N7002
R1 N002 IN {5*R_pull}
R4 N003 IN {5*R_pull}
M5 N002 #EN G G 2N7002
M6 N003 N005 G G BSS84
R5 N005 V- {R_pull}
M7 N005 #EN G G BSS84
R6 OUT G {R_pull}
.ends tri_buffer2

.subckt tri_max1 G IN1 IN2 V+ V- OUT
M1 N001 IN1 G G 2N7002
D1 IN1 V+ BAT46WJ
D2 V- IN1 BAT46WJ
R2 V+ N001 {R_pull}
M3 N002 N001 V+ V+ BSS84
R9 N002 V- {5*R_pull}
R3 G N003 {R_pull}
M4 N004 N003 G G BSS84
R4 N002 N004 {R_pull/2}
M2 N003 IN1 V- V- 2N7002
M5 N005 IN2 G G 2N7002
D3 IN2 V+ BAT46WJ
D4 V- IN2 BAT46WJ
R6 V+ N005 {R_pull}
M7 N002 N005 V+ V+ BSS84
R7 G N006 {R_pull}
M8 N007 N006 G G BSS84
R8 N002 N007 {R_pull/2}
M6 N006 IN2 V- V- 2N7002
XB2 V+ V- N002 OUT G tri_buffer1
.ends tri_max1

.subckt tri_buffer1 V+ V- IN OUT G
M1 N001 IN G G 2N7002
M2 N002 IN G G BSS84
D1 IN V+ BAT46WJ
D2 V- IN BAT46WJ
R2 N002 V- {R_pull}
R3 V+ N001 {R_pull}
M3 OUT N001 V+ V+ BSS84
M4 OUT N002 V- V- 2N7002
R4 OUT G {R_pull}
.ends tri_buffer1

.subckt tri_sigadd V+ V- IN1 OUT G IN2
M5 N001 IN1 V+ V+ BSS84
M6 N002 N001 V+ V+ BSS84
R1 N001 G {R_pull}
M7 N003 IN2 V+ V+ BSS84
M8 OUT N003 N002 N002 BSS84
R5 N003 G {R_pull}
R6 OUT G {R_pull}
M9 OUT N004 N006 N006 2N7002
M10 N004 IN1 V- V- 2N7002
R7 G N004 {R_pull}
M11 N006 N005 V- V- 2N7002
M12 N005 IN2 V- V- 2N7002
R8 G N005 {R_pull}
D3 IN1 V+ BAT46WJ
D4 V- IN1 BAT46WJ
D1 IN2 V+ BAT46WJ
D2 V- IN2 BAT46WJ
.ends tri_sigadd

.model D D
.lib standard.dio
.model NMOS NMOS
.model PMOS PMOS
.lib standard.mos
.tran 40m
.Parteispendenaffäre R_pull=10k
* https://www.mikrocontroller.net/topic/246824#2523691
.backanno
.end